# Altium schematic sheet ETH-W5500.SchDoc
size A4; SheetNumber: 2; SheetTotal: 5
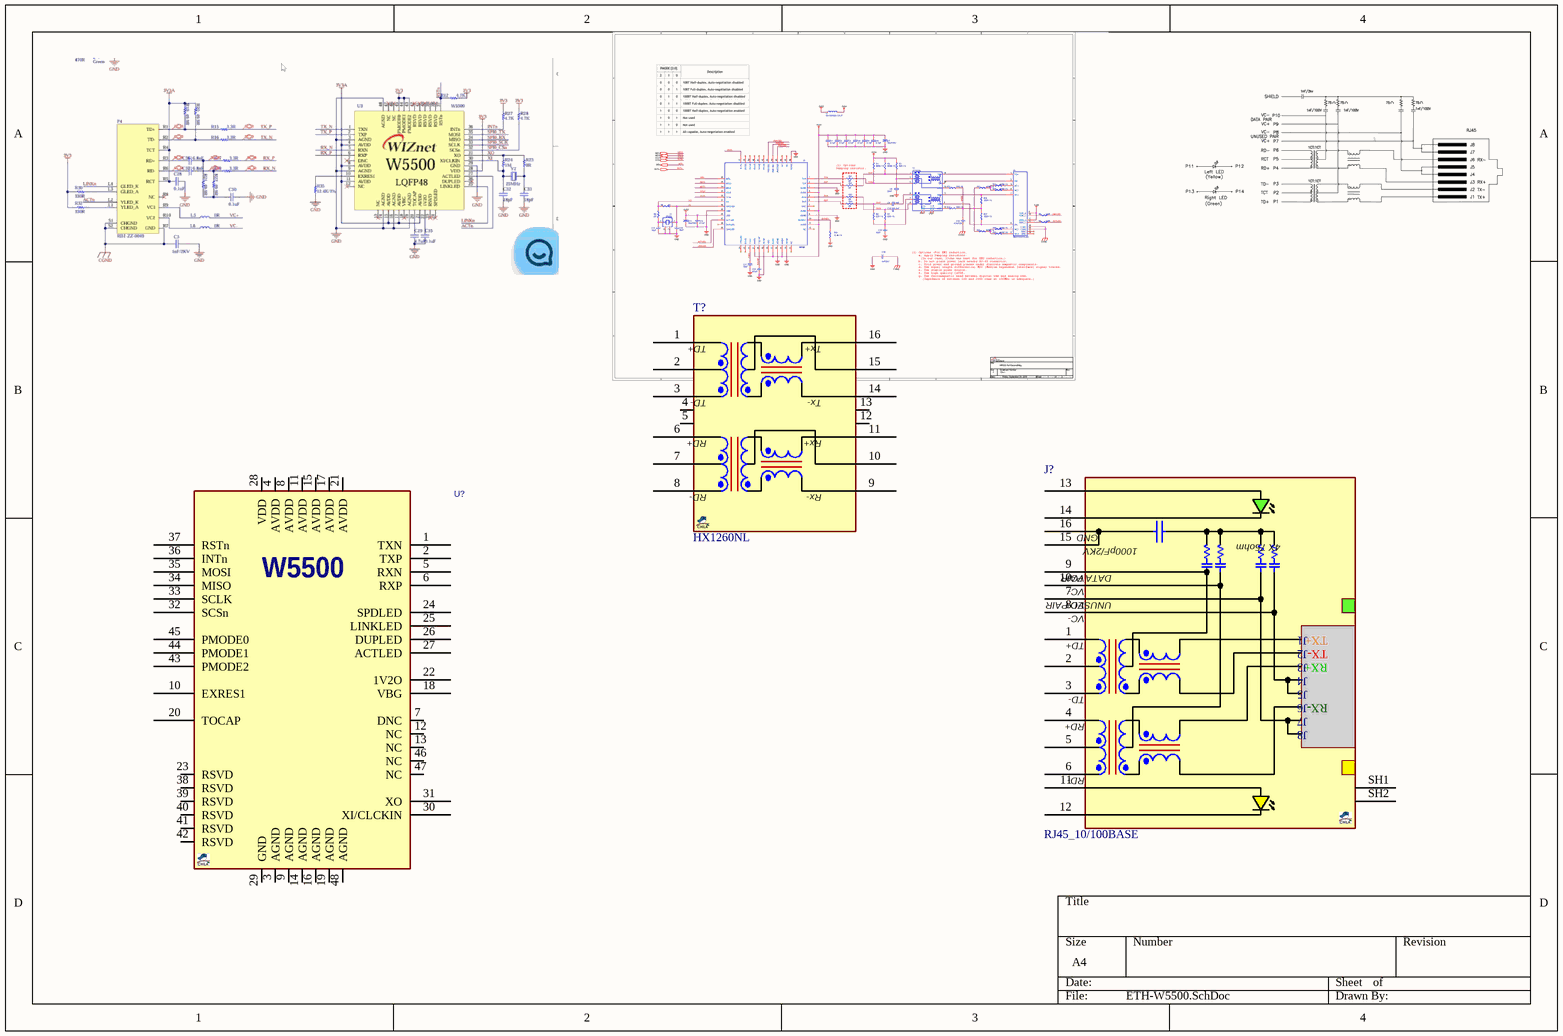
[diagram p0: ETH-W5500.SchDoc]

## Parts
J?  RJ45_10/100BASE  [RJ45_10M_RJ000002]
T?  HX1260NL  [SO_16_7W6H]
U?  (no value)  [QFG50_48]

## Nets

Not connected (* = marked no-connect by the designer): J? 1(TD+) 2(TCT) 3(TD-) 4(RD+) 5(RCT) 6(RD-) 7(VCU+) 8(VCU-) 9(VCD+) 10(VCD-) 11(YLED+) 12(YLED-) 13(GLED+) 14(GLED-) 15(P15) 16(CHSGND) SH1 SH2; T? 1(TD+) 2(CTD) 3(TD-) 4(NC_1) 5(NC_2) 6(RD+) 7(CRD) 8(RD-) 9(RX-) 10(CRX) 11(RX+) 12(NC_3) 13(NC_4) 14(TX-) 15(CTX) 16(TX+); U? 1(TXN) 2(TXP) 3(AGND) 4(AVDD) 5(RXN) 6(RXP) 7(DNC) 8(AVDD) 9(AGND) 10(EXRES1) 11(AVDD) 12(NC) 13(NC) 14(AGND) 15(AVDD) 16(AGND) 17(AVDD) 18(VBG) 19(AGND) 20(TOCAP) 21(AVDD) 22(1V2O) 23(RSVD) 24(SPDLED) 25(LINKLED) 26(DUPLED) 27(ACTLED) 28(VDD) 29(GND) 30(XI/CLCKIN) 31(XO) 32(SCSn) 33(SCLK) 34(MISO) 35(MOSI) 36(INTn) 37(RSTn) 38(RSVD) 39(RSVD) 40(RSVD) 41(RSVD) 42(RSVD) 43(PMODE2) 44(PMODE1) 45(PMODE0) 46(NC) 47(NC) 48(AGND)

## Notes on the sheet
- (in symbol HX1260NL_SO16) Tx+; Tx-; Rx+; Rx-
- (in symbol RJ45_RJ000002) GND; 4X 75ohm; 1000pF/2KV; VC+; DATA PAIR; VC-; UNUSED PAIR; J1; TX+; J2; TX-; J3; RX+; J4; J5; J6; RX-; J7; J8

## Library data of the parts
J? = RJ45_RJ000002: RJ45, 10/100BASE, G/Y LED; MANF: LINK-PP, YCL; MANF_P#: RJ000002; PARAM2: 10/100BASE, G/Y LED; VALUE: RJ45_10/100BASE
T? = HX1260NL_SO16: Transformer, LAN, 100 Base-T , 1CT:1CT, 350uH; MANF: Pulse; PARAM2: 1CT:1CT, 350uH, 0~70°C; MANF_P#: HX1260NL; PARAM: LAN, 100 Base-T; PRICE: 4.5$; VALUE: HX1260NL
U? = W5500_QFP48: Ethernet Controller, 10/100, SPI, DMA; MANF: WIZNET; MANF_P#: W5500